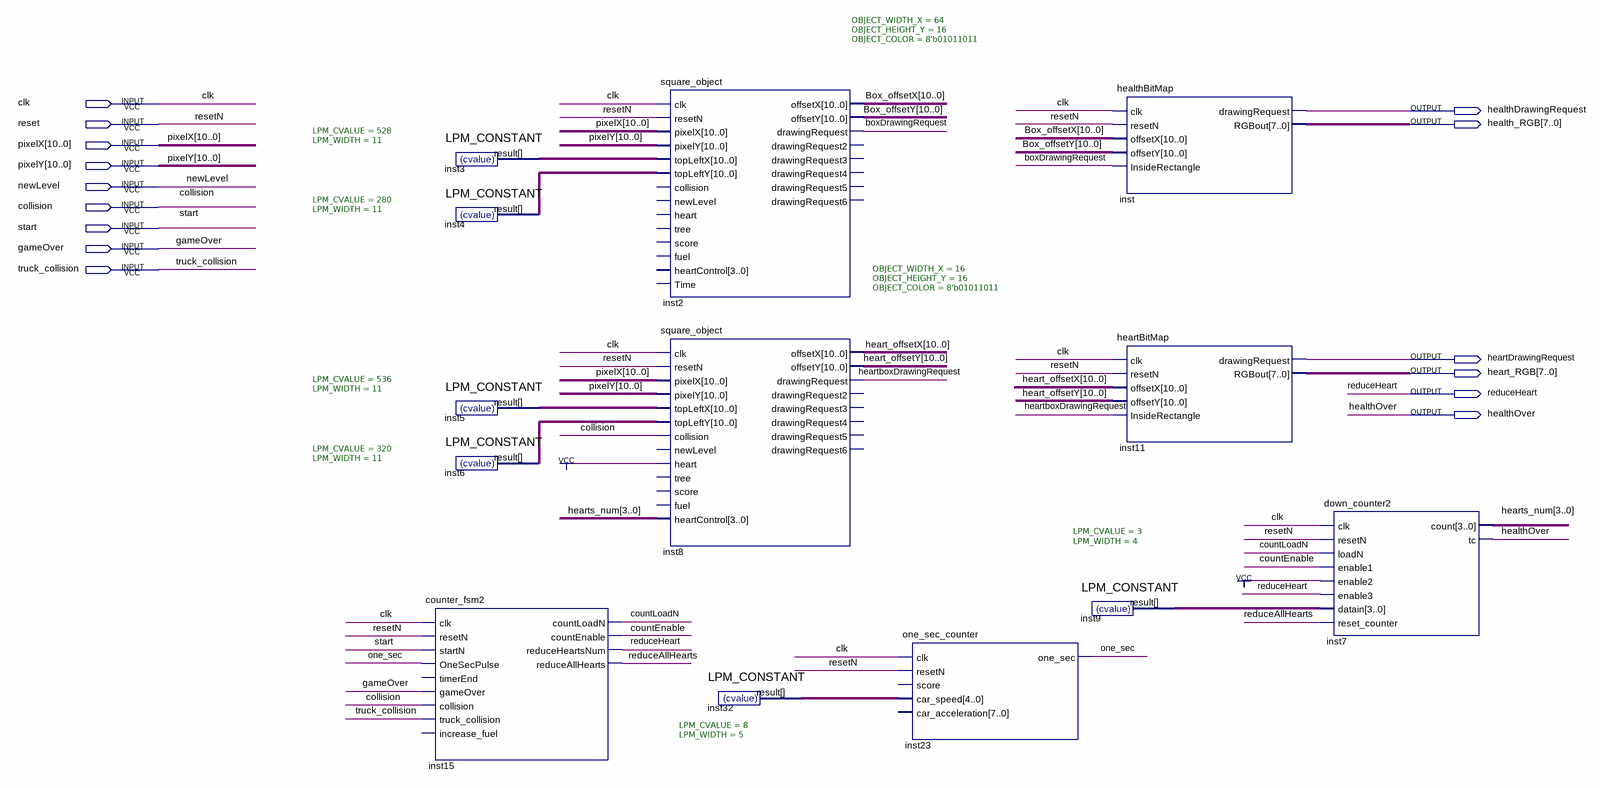
[diagram p0: schematic sheet]
// Quartus schematic health_Block.bdf as structural Verilog: 13 symbols, 15 pins
module health_Block (
  input  clk,
  input  reset,
  input  [10:0] pixelX,
  input  [10:0] pixelY,
  input  newLevel,
  input  collision,
  input  start,
  input  gameOver,
  input  truck_collision,
  output healthDrawingRequest,
  output [7:0] health_RGB,
  output heartDrawingRequest,
  output [7:0] heart_RGB,
  output reduceHeart,
  output healthOver
);

  wire boxDrawingRequest, countEnable, countLoadN, heartboxDrawingRequest, one_sec, reduceAllHearts;
  wire [3:0] hearts_num, inst9_result;
  wire [4:0] inst32_result;
  wire [10:0] Box_offsetX, Box_offsetY, heart_offsetX, heart_offsetY, inst3_result, inst4_result,
       inst5_result, inst6_result;

  counter_fsm2 inst15 (
    .clk(clk), .resetN(reset), .startN(start), .OneSecPulse(one_sec), .gameOver(gameOver),
    .collision(collision), .truck_collision(truck_collision), .countLoadN(countLoadN),
    .countEnable(countEnable), .reduceHeartsNum(reduceHeart), .reduceAllHearts(reduceAllHearts));  // open: timerEnd, increase_fuel
  LPM_CONSTANT #(.LPM_CVALUE(528), .LPM_WIDTH(11)) inst3 (.result(inst3_result));
  LPM_CONSTANT #(.LPM_CVALUE(280), .LPM_WIDTH(11)) inst4 (.result(inst4_result));
  LPM_CONSTANT #(.LPM_CVALUE(536), .LPM_WIDTH(11)) inst5 (.result(inst5_result));
  LPM_CONSTANT #(.LPM_CVALUE(320), .LPM_WIDTH(11)) inst6 (.result(inst6_result));
  square_object #(.OBJECT_WIDTH_X(64), .OBJECT_HEIGHT_Y(16), .OBJECT_COLOR(8'b01011011)) inst2 (
    .clk(clk), .resetN(reset), .pixelX(pixelX), .pixelY(pixelY), .topLeftX(inst3_result),
    .topLeftY(inst4_result), .offsetX(Box_offsetX), .offsetY(Box_offsetY), .drawingRequest(boxDrawingRequest));  // open: collision, newLevel, heart, tree, score, fuel, heartControl, Time, drawingRequest2, drawingRequest3, drawingRequest4, drawingRequest5, drawingRequest6
  square_object #(.OBJECT_WIDTH_X(16), .OBJECT_HEIGHT_Y(16), .OBJECT_COLOR(8'b01011011)) inst8 (
    .clk(clk), .resetN(reset), .pixelX(pixelX), .pixelY(pixelY), .topLeftX(inst5_result),
    .topLeftY(inst6_result), .collision(collision), .heart(1'b1), .heartControl(hearts_num),
    .offsetX(heart_offsetX), .offsetY(heart_offsetY), .drawingRequest(heartboxDrawingRequest));  // open: newLevel, tree, score, fuel, drawingRequest2, drawingRequest3, drawingRequest4, drawingRequest5, drawingRequest6
  LPM_CONSTANT #(.LPM_CVALUE(8), .LPM_WIDTH(5)) inst32 (.result(inst32_result));
  one_sec_counter inst23 (
    .clk(clk), .resetN(reset), .car_speed(inst32_result), .one_sec(one_sec));  // open: score, car_acceleration
  LPM_CONSTANT #(.LPM_CVALUE(3), .LPM_WIDTH(4)) inst9 (.result(inst9_result));
  healthBitMap inst (
    .clk(clk), .resetN(reset), .offsetX(Box_offsetX), .offsetY(Box_offsetY),
    .InsideRectangle(boxDrawingRequest), .drawingRequest(healthDrawingRequest), .RGBout(health_RGB));
  heartBitMap inst11 (
    .clk(clk), .resetN(reset), .offsetX(heart_offsetX), .offsetY(heart_offsetY),
    .InsideRectangle(heartboxDrawingRequest), .drawingRequest(heartDrawingRequest), .RGBout(heart_RGB));
  down_counter2 inst7 (
    .clk(clk), .resetN(reset), .loadN(countLoadN), .enable1(countEnable), .enable2(1'b1),
    .enable3(reduceHeart), .datain(inst9_result), .reset_counter(reduceAllHearts), .count(hearts_num),
    .tc(healthOver));

  // Other names for the same wires on the sheet: resetN = reset
endmodule
